# Altium project node 1.1.PrjPcb
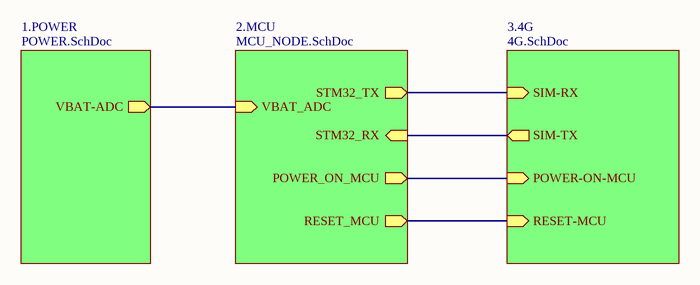
[diagram p0: NODE 1.1.SchDoc]
4 sheets, 115 parts. Net scope: hierarchical (ports join the sheet entries above them; power ports are global).
Sheets:
  NODE 1.1.SchDoc
    1.POWER = POWER.SchDoc
    2.MCU = MCU_NODE.SchDoc
    3.4G = 4G.SchDoc

## Sheet NODE 1.1.SchDoc
size A

### Sub-sheets
1.POWER = POWER.SchDoc: VBAT-ADC (out)
2.MCU = MCU_NODE.SchDoc: VBAT_ADC (in), STM32_TX (out), STM32_RX (in), POWER_ON_MCU (out), RESET_MCU (out)
3.4G = 4G.SchDoc: SIM-RX (in), SIM-TX (out), POWER-ON-MCU (in), RESET-MCU (in)

### Nets
NetC?#15_2: sheet 1.POWER/VBAT-ADC, sheet 2.MCU/VBAT_ADC
NetIC?#6_1: sheet 2.MCU/STM32_TX, sheet 3.4G/SIM-RX
NetIC?#6_8: sheet 2.MCU/STM32_RX, sheet 3.4G/SIM-TX
NetR?#26_2: sheet 2.MCU/RESET_MCU, sheet 3.4G/RESET-MCU
NetR?#28_2: sheet 2.MCU/POWER_ON_MCU, sheet 3.4G/POWER-ON-MCU

## Sheet POWER.SchDoc
size A
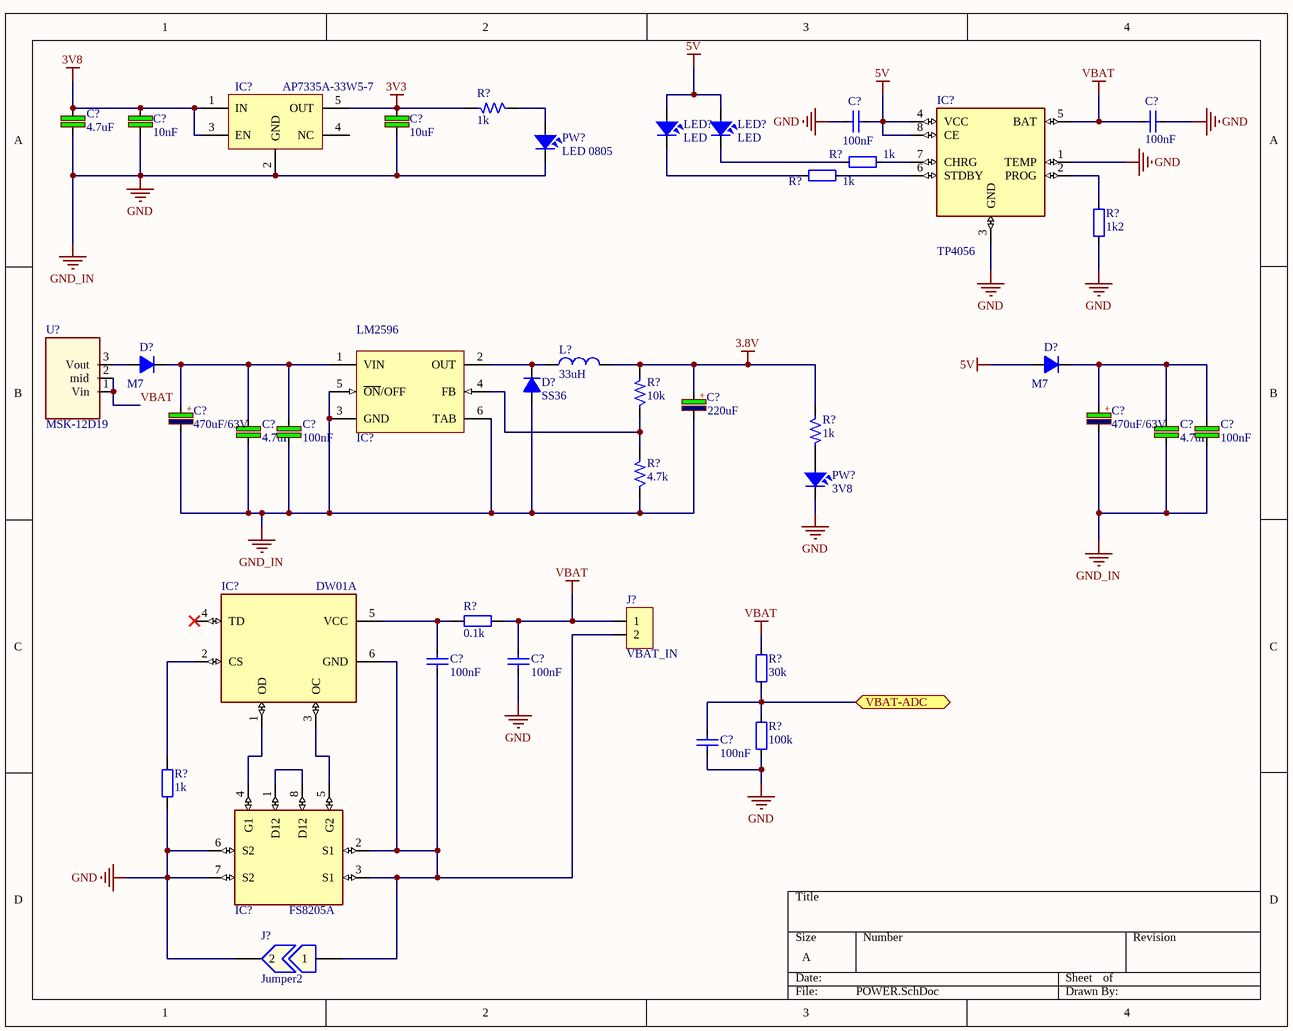
[diagram p1: POWER.SchDoc]

### Parts
(Parts that share a designator on the sheet are numbered #1, #2 ... from top to bottom, then left to right.)
C?#1  4.7uF  [C-0805]
C?#2  10nF  [C-0805]
C?#3  10uF  [C-0805]
C?#4  100nF  [CAP_0805]
C?#5  100nF  [CAP_0805]
C?#6  220uF  [EEFSDE]
C?#7  470uF/63V  [CAP-ALU-SMD-C]
C?#8  470uF/63V  [CAP-ALU-SMD-C]
C?#9  4.7uF  [C-0805]
C?#10  value 100nF  [C-0805]  (hidden comment: 4.7uF)
C?#11  4.7uF  [C-0805]
C?#12  value 100nF  [C-0805]  (hidden comment: 4.7uF)
C?#13  100nF  [CAP_0805]
C?#14  100nF  [CAP_0805]
C?#15  100nF  [CAP_0805]
D?#1  M7  [DIODE SMA]
D?#2  M7  [LED-0805-Blue]
D?#3  SS36  [DIODE SMA]
IC?#1  AP7335A-33W5-7  [SOT23-5]
IC?#2  TP4056  [TP4056]
IC?#3  LM2596  [TO-263]
IC?#4  DW01A  [SOT23-6]
IC?#5  FS8205A  [FS8205A]
J?#1  VBAT_IN  [JP2-D1T]
J?#2  Jumper2  [RES-SMD-0201]
L?#1  33uH  [Inductor_SMD]
LED?#1  LED  [LED-0805-Red]
LED?#2  LED  [LED-0805-Green]
PW?#1  LED 0805  [LED-0805-Blue]
PW?#2  3V8  [LED-0805-Blue]
R?#1  1k  [R-0805]
R?#2  1k  [RES-SMD-0805]
R?#3  1k  [RES-SMD-0805]
R?#4  1k2  [RES-SMD-0805]
R?#5  10k  [R-0805]
R?#6  1k  [R-0805]
R?#7  4.7k  [R-0805]
R?#8  0.1k  [RES-SMD-0805]
R?#9  30k  [RES-SMD-0805]
R?#10  100k  [RES-SMD-0805]
R?#11  1k  [RES-SMD-0805]
U?#1  MSK-12D19  [Switch]

### Ports
VBAT-ADC (bidir)

### Nets
3.8V: C?#6.1 L?#1.2 R?#5.2 R?#6.1
3V3: C?#3.1 IC?#1.5(OUT) R?#1.2
3V8: C?#1.2 C?#2.1 IC?#1.1(IN) IC?#1.3(EN)
5V: C?#4.1 D?#2.1(A) IC?#2.4(VCC) IC?#2.8(CE) LED?#1.1 LED?#2.1
GND: C?#1.1 C?#2.2 C?#3.2 C?#4.2 C?#5.1 C?#6.2 C?#7.2 C?#8.2 C?#9.1 C?#10.1 C?#11.1 C?#12.1 C?#14.1 C?#15.1 D?#3.1(A) IC?#1.2(GND) IC?#2.1(TEMP) IC?#2.3(GND) IC?#3.3(GND) IC?#3.5(~{ON}/OFF) IC?#3.6(TAB) IC?#5.6(S2) IC?#5.7(S2) J?#2.2 PW?#1.2 PW?#2.2 R?#4.1 R?#7.1 R?#10.2 R?#11.2  [also labelled GND_IN]
VBAT: C?#5.2 C?#14.2 IC?#2.5(BAT) J?#1.1 R?#8.2 R?#9.1 U?#1.1(Vin) U?#1.2(mid)
NetC?#7_1: C?#7.1 C?#9.2 C?#10.2 D?#1.2(K) IC?#3.1(VIN)
NetC?#8_1: C?#8.1 C?#11.2 C?#12.2 D?#2.2(K)
NetC?#13_1: C?#13.1 IC?#4.6(GND) IC?#5.2(S1) IC?#5.3(S1) J?#1.2 J?#2.1
NetC?#13_2: C?#13.2 IC?#4.5(VCC) R?#8.1
NetC?#15_2: C?#15.2 R?#9.2 R?#10.1 ; port VBAT-ADC
NetD?#1_1: D?#1.1(A) U?#1.3(Vout)
NetD?#3_2: D?#3.2(K) IC?#3.2(OUT) L?#1.1
NetIC?#2_2: IC?#2.2(PROG) R?#4.2
NetIC?#2_6: IC?#2.6(STDBY) R?#3.1
NetIC?#2_7: IC?#2.7(CHRG) R?#2.1
NetIC?#3_4: IC?#3.4(FB) R?#5.1 R?#7.2
NetIC?#4_1: IC?#4.1(OD) IC?#5.4(G1)
NetIC?#4_2: IC?#4.2(CS) R?#11.1
NetIC?#4_3: IC?#4.3(OC) IC?#5.5(G2)
NetIC?#5_1: IC?#5.1(D12) IC?#5.8(D12)
NetLED?#1_2: LED?#1.2 R?#3.2
NetLED?#2_2: LED?#2.2 R?#2.2
NetPW?#1_1: PW?#1.1 R?#1.1
NetPW?#2_1: PW?#2.1 R?#6.2

Not connected (* = marked no-connect by the designer): IC?#1 4(NC); IC?#4 4(TD)*

### Notes on the sheet
- (in symbol CP3) +
- (in symbol CP5) +

### Library data of the parts
C?#1 C?#9-C?#12 = C: 4.7µF ±10% 35V Ceramic Capacitor X5R 0805 (2012 Metric); Manufacturer: Samsung Electro-Mechanics; Part number: CL21A475KLCLQNC; User_Description: CAP CER 4.7UF 35V X5R 0805; Category: CAPACITOR; Package: 0805
  C?#1 C?#9 C?#11: Value: 4.7uF
C?#2 = C: Cap SMD; Manufacturer: Samsung Electro-Mechanics; Part number: CL21A106KPFNNNG; Value: 10uF; User_Description: CAP CER 10UF 10V X5R 0805; Category: CAPACITOR; Package: 0805
C?#3 = C: Cap SMD; Manufacturer: Samsung Electro-Mechanics; Part number: CL21A106KPFNNNG; User_Description: CAP CER 10UF 10V X5R 0805; Value: 10uF; Category: CAPACITOR; Package: 0805
C?#4 C?#5 C?#13-C?#15 = CapSMD: Capacitor; Value: 33p; Published: 8-Jun-2000; LatestRevisionDate: 17-Jul-2002; LatestRevisionNote: Re-released for DXP Platform.; PackageReference: RAD-0.3; Publisher: Altium Limited
C?#6 = CP5: 220µF Molded Tantalum Polymer Capacitor 16V 2917 (7343 Metric) 40mOhm @ 100kHz; Manufacturer: AVX Corporation; Part number: TCME227M016R0040E; User_Description: CAP TANT POLY 220UF 16V 2917; Value: 220uF; Category: CAPACITOR; Package: 2917
C?#7 C?#8 = CP3: Cap 470uF/63V; Value: Cap 470uF/63V
D?#1 D?#2 = D1A: Diode 1A; Value: 1N4007
D?#3 = B340A: Diode Schottky 40V 3A Surface Mount DO-214AC (SMA); Manufacturer: Vishay General Semiconductor - Diodes Division; Part number: B340A-M3/61T; User_Description: DIODE SCHOTTKY 40V 3A DO214AC; Value: 40V 3A; Category: DIODE; Package: DO214AC
IC?#2 = TP4056: Complete single cell Li-Ion battery with a constant current / constant voltage linear charger
IC?#3 = LM2576
IC?#4 = DW01A: One Cell Lithium-ion/Polymer Battery Protection IC
J?#1 = JP2: WR-PHD 2.54 mm Angled Socket Header; Manufacturer: W¨¹rth Elektronik eiSos GmbH; partNo: 613002143121; ComponentLink1 Description: Manufacturer; ComponentLink2 Description: Datasheet; NoPins: 02; Created Date: 29 March 2013; ComponentLink1URL: http://www.we-online.com; ComponentLink2URL: http://katalog.we-online.de/em/datasheet/6130xx143121.pdf; Created by: Karrer Zheng
J?#2 = Jumper2: Jumper, 2-Pin
L?#1 = L1: 22µH Shielded Inductor 1.65A 96mOhm Max Nonstandard; Manufacturer: Bourns Inc.; Part Number: SRR0745A-220M; Value: 220uH; User_Description: FIXED IND 22UH 1.65A 96 MOHM SMD; Category: INDUCTORS; Package: SMD
LED?#1 LED?#2 = LED: LED Single colour Green and Red; Value: LED 3 ly Single Colour
PW?#1 PW?#2 = LED: LED RED DIFFUSED 0805 SMD; Manufacturer: OSRAM Opto Semiconductors Inc.; Part number: LS R976-NR-1; Value: Red; Category: LED SMD; Package: 0805; User_Description: LED RED DIFFUSED 0805 SMD
R?#1 R?#6 = R: Resistor 1/4W; Manufacturer: Yageo; Part number: RC0805FR-071KL; User_Description: RES SMD 1K OHM 1% 1/8W 0805; Value: 1k; Category: RESISTORS; Package: 0805
R?#2-R?#4 R?#9 R?#10 = Resistor - SMD: Resistor; Manufacturer: Generic Components; Class: Passive; Published: 08/06/2000; Publisher: Altium Hobart Technology Centre
R?#5 = R: RES SMD 10K OHM 1% 1/8W 0805; Manufacturer: Yageo; Part number: RC0805FR-0710KL; Category: RESISTORS; Package: 0805; User_Description: RES SMD 10K OHM 1% 1/8W 0805; Value: 10k
R?#7 = R: RES SMD 3.3K OHM 1% 1/8W 0805; Manufacturer: Yageo; Part number: RC0805FR-073K3L; Category: RESISTORS; Package: 0805; User_Description: RES SMD 3.3K OHM 1% 1/8W 0805; Value: 3.3k
R?#8 R?#11 = Resistor - SMD: Resistor SMD; Manufacturer: Generic Components; Class: Passive; Published: 08/06/2000; Publisher: Altium Hobart Technology Centre
U?#1 = switch
IC?#1 = AP7335A-33W5-7: Package: SOT23-5; Part number: AP7335A-33W5-7

## Sheet MCU_NODE.SchDoc
size A
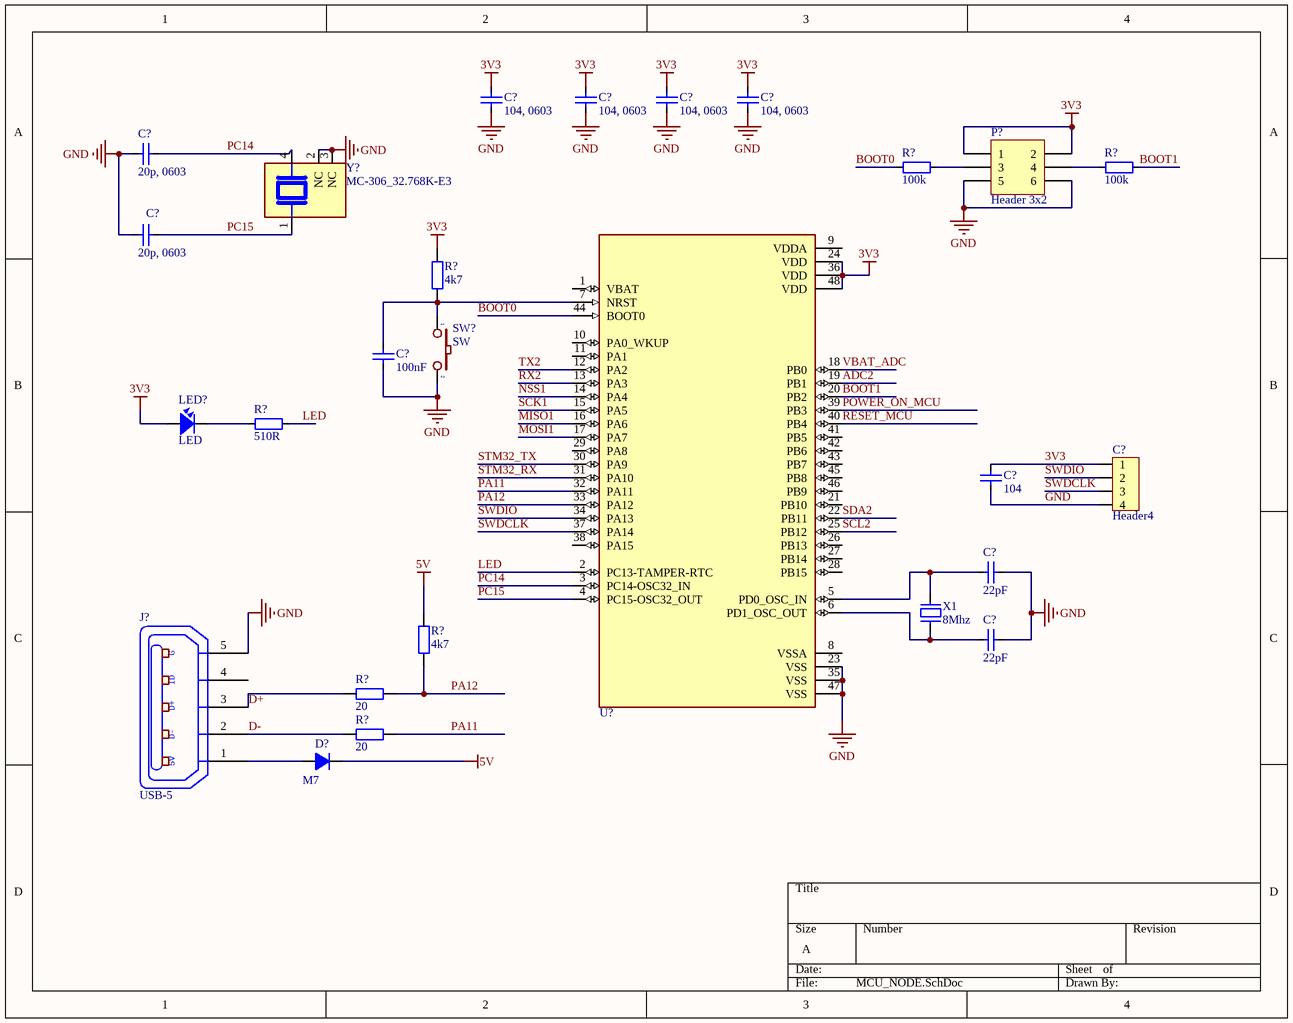
[diagram p2: MCU_NODE.SchDoc]

### Parts
(Parts that share a designator on the sheet are numbered #1, #2 ... from top to bottom, then left to right.)
C?#16  104, 0603  [CAP_0805]
C?#17  104, 0603  [CAP_0805]
C?#18  104, 0603  [CAP_0805]
C?#19  104, 0603  [CAP_0805]
C?#20  20p, 0603  [CAP_0805]
C?#21  20p, 0603  [CAP_0805]
C?#22  100nF  [CAP_0402]
C?#23  Header4  [HDR4]
C?#24  104  [CAP_0402]
C?#25  22pF  [CAP_0402]
C?#26  22pF  [CAP_0402]
D?#4  M7  [LED-0805-Blue]
J?#3  USB-5  [USB-M1]
LED?#3  LED  [LED-0805-Blue]
P?#1  Header 3x2  [Header 3x2]
R?#12  100k  [RES-SMD-0805]
R?#13  100k  [RES-SMD-0805]
R?#14  4k7  [RES-SMD-0805]
R?#15  510R  [RES-SMD-0805]
R?#16  4k7  [RES-SMD-0805]
R?#17  20  [RES-SMD-0805]
R?#18  20  [RES-SMD-0101]
SW?#1  SW  [SW2]
U?#2  STM32  [LQFP 48]  (value not drawn)
X1  8Mhz  [XT2]
Y?  MC-306_32.768K-E3  [XTAL_MC-306_32.768K-E3]

### Nets
3V3: C?#16.2 C?#17.2 C?#18.2 C?#19.2 C?#23.1 C?#24.2 LED?#3.1 P?#1.1 P?#1.2 R?#14.1 U?#2.24(VDD) U?#2.36(VDD) U?#2.48(VDD)
5V: D?#4.2(K) R?#16.2
GND: C?#16.1 C?#17.1 C?#18.1 C?#19.1 C?#20.1 C?#21.1 C?#22.1 C?#23.4 C?#24.1 C?#25.2 C?#26.2 J?#3.5(P5) P?#1.5 P?#1.6 SW?#1.2 U?#2.23(VSS) U?#2.35(VSS) U?#2.47(VSS) Y?.2(NC) Y?.3(NC)
ADC2: U?#2.19(PB1)
BOOT0: R?#12.2 U?#2.44(BOOT0)
BOOT1: R?#13.1 U?#2.20(PB2)
D+: J?#3.3(P3) R?#17.1
D-: J?#3.2(P2) R?#18.1
LED: R?#15.1 U?#2.2(PC13-TAMPER-RTC)
MISO1: U?#2.16(PA6)
MOSI1: U?#2.17(PA7)
NSS1: U?#2.14(PA4)
PA11: R?#18.2 U?#2.32(PA11)
PA12: R?#16.1 R?#17.2 U?#2.33(PA12)
PC14: C?#20.2 U?#2.3(PC14-OSC32_IN) Y?.4
PC15: C?#21.2 U?#2.4(PC15-OSC32_OUT) Y?.1
POWER_ON_MCU: U?#2.39(PB3)
RESET_MCU: U?#2.40(PB4)
RX2: U?#2.13(PA3)
SCK1: U?#2.15(PA5)
SCL2: U?#2.25(PB12)
SDA2: U?#2.22(PB11)
STM32_RX: U?#2.31(PA10)
STM32_TX: U?#2.30(PA9)
SWDCLK: C?#23.3 U?#2.37(PA14)
SWDIO: C?#23.2 U?#2.34(PA13)
TX2: U?#2.12(PA2)
VBAT_ADC: U?#2.18(PB0)
NetC?#22_2: C?#22.2 R?#14.2 SW?#1.1 U?#2.7(NRST)
NetC?#25_1: C?#25.1 U?#2.5(PD0_OSC_IN) X1.2
NetC?#26_1: C?#26.1 U?#2.6(PD1_OSC_OUT) X1.1
NetD?#4_1: D?#4.1(A) J?#3.1(P1)
NetLED?#3_2: LED?#3.2 R?#15.2
NetP?#1_3: P?#1.3 R?#12.1
NetP?#1_4: P?#1.4 R?#13.2

Not connected (* = marked no-connect by the designer): J?#3 4(P4); U?#2 1(VBAT) 8(VSSA) 9(VDDA) 10(PA0_WKUP) 11(PA1) 21(PB10) 26(PB13) 27(PB14) 28(PB15) 29(PA8) 38(PA15) 41(PB5) 42(PB6) 43(PB7) 45(PB8) 46(PB9)

### Notes on the sheet
- (in symbol USB-5) G; ID; D+; D-; 5V

### Library data of the parts
C?#16-C?#22 C?#24-C?#26 = CapSMD: Capacitor; Value: 33p; Published: 8-Jun-2000; LatestRevisionDate: 17-Jul-2002; LatestRevisionNote: Re-released for DXP Platform.; PackageReference: RAD-0.3; Publisher: Altium Limited
C?#23 = Header4: Header IDC, 4 x 1 Pin Vertical 2.54mm Pitch (Non-Boxed, Male); Manufacturer: W¨¹rth Elektronik eiSos GmbH; partNo: 613002143121; ComponentLink1 Description: Manufacturer; ComponentLink2 Description: Datasheet; NoPins: 02; Created Date: 29 March 2013; ComponentLink1URL: http://www.we-online.com; ComponentLink2URL: http://katalog.we-online.de/em/datasheet/6130xx143121.pdf; Created by: Karrer Zheng
D?#4 = D1A: Diode 1A; Value: 1N4007
J?#3 = USB-5: Manufacturer: FCI; Manufacturer Part Number: 10118193-0001LF; Connector Type: USB - micro B; Number of Contacts: 5; Gender: Receptacle; Specifications: USB 2.0; .Creator: MM; .Checked PCB: RF; Supplier 1: Digi-Key; RoHS: RoHS Compliant; Category: Connectors, Interconnects; Stock 1: 28642; Pricing 1: 1=0.46, 10=0.433, 25=0.3712, 50=0.3156, 100=0.3032, 250=0.27224, 500=0.25988 (USD); Packaging: Cut Tape (CT); Mounting Type: Surface Mount, Right Angle, Horizontal; Features: Shielded, Solder Retention; Ingress Protection: -; ComponentLink1URL: http://portal.fciconnect.com/Comergent//fci/drawing/10118193.pdf; ComponentLink1Description: http://portal.fciconnect.com/Comergent//fci/drawing/10118193.pdf; Supplier Part Number 1: 609-4616-1-ND; .Checked SCH: MM
LED?#3 = LED: as LED?#1 on sheet POWER
P?#1 = Header 3x2: Header, 6-Pin, 2-Row; LatestRevisionDate: 17-Jul-2002; LatestRevisionNote: Re-released for DXP Platform.; Publisher: Altium Limited
R?#12 R?#13 R?#15 = Resistor - SMD: as R?#2 on sheet POWER; Published: 08/06/2000; Publisher: Altium Hobart Technology Centre
R?#14 R?#16-R?#18 = Resistor - SMD: as R?#8 on sheet POWER; Published: 08/06/2000; Publisher: Altium Hobart Technology Centre
SW?#1 = SW2: Switch button 2 pin; Value: SW chip 2 pin
U?#2 = STM32F103C8T6: STM32 ARM-based 32-bit MCU with 64 Kbytes Flash, 64-pin LQFP, Industrial Temperature
X1 = XT2: Crystal For all Crystal 2pin.; Value: 4Mhz
Y? = MC-306_32.768K-E3: CRYSTAL 32.7680KHZ 6PF SMD; MF: EPSON; MP: MC-306 32.768K-E3; Check_prices: https://www.snapeda.com/parts/MC-306%2032.768K-E3/EPSON/view-part/?ref=eda; Package: NON STANDARD-4 EPSON; Value: *; Price: None; Purchase-URL: https://pricing.snapeda.com/search/part/MC-306 32.768K-E3/?ref=eda; SnapEDA_Link: https://www.snapeda.com/parts/MC-306%2032.768K-E3/EPSON/view-part/?ref=snap; Availability: In Stock

## Sheet 4G.SchDoc
size B
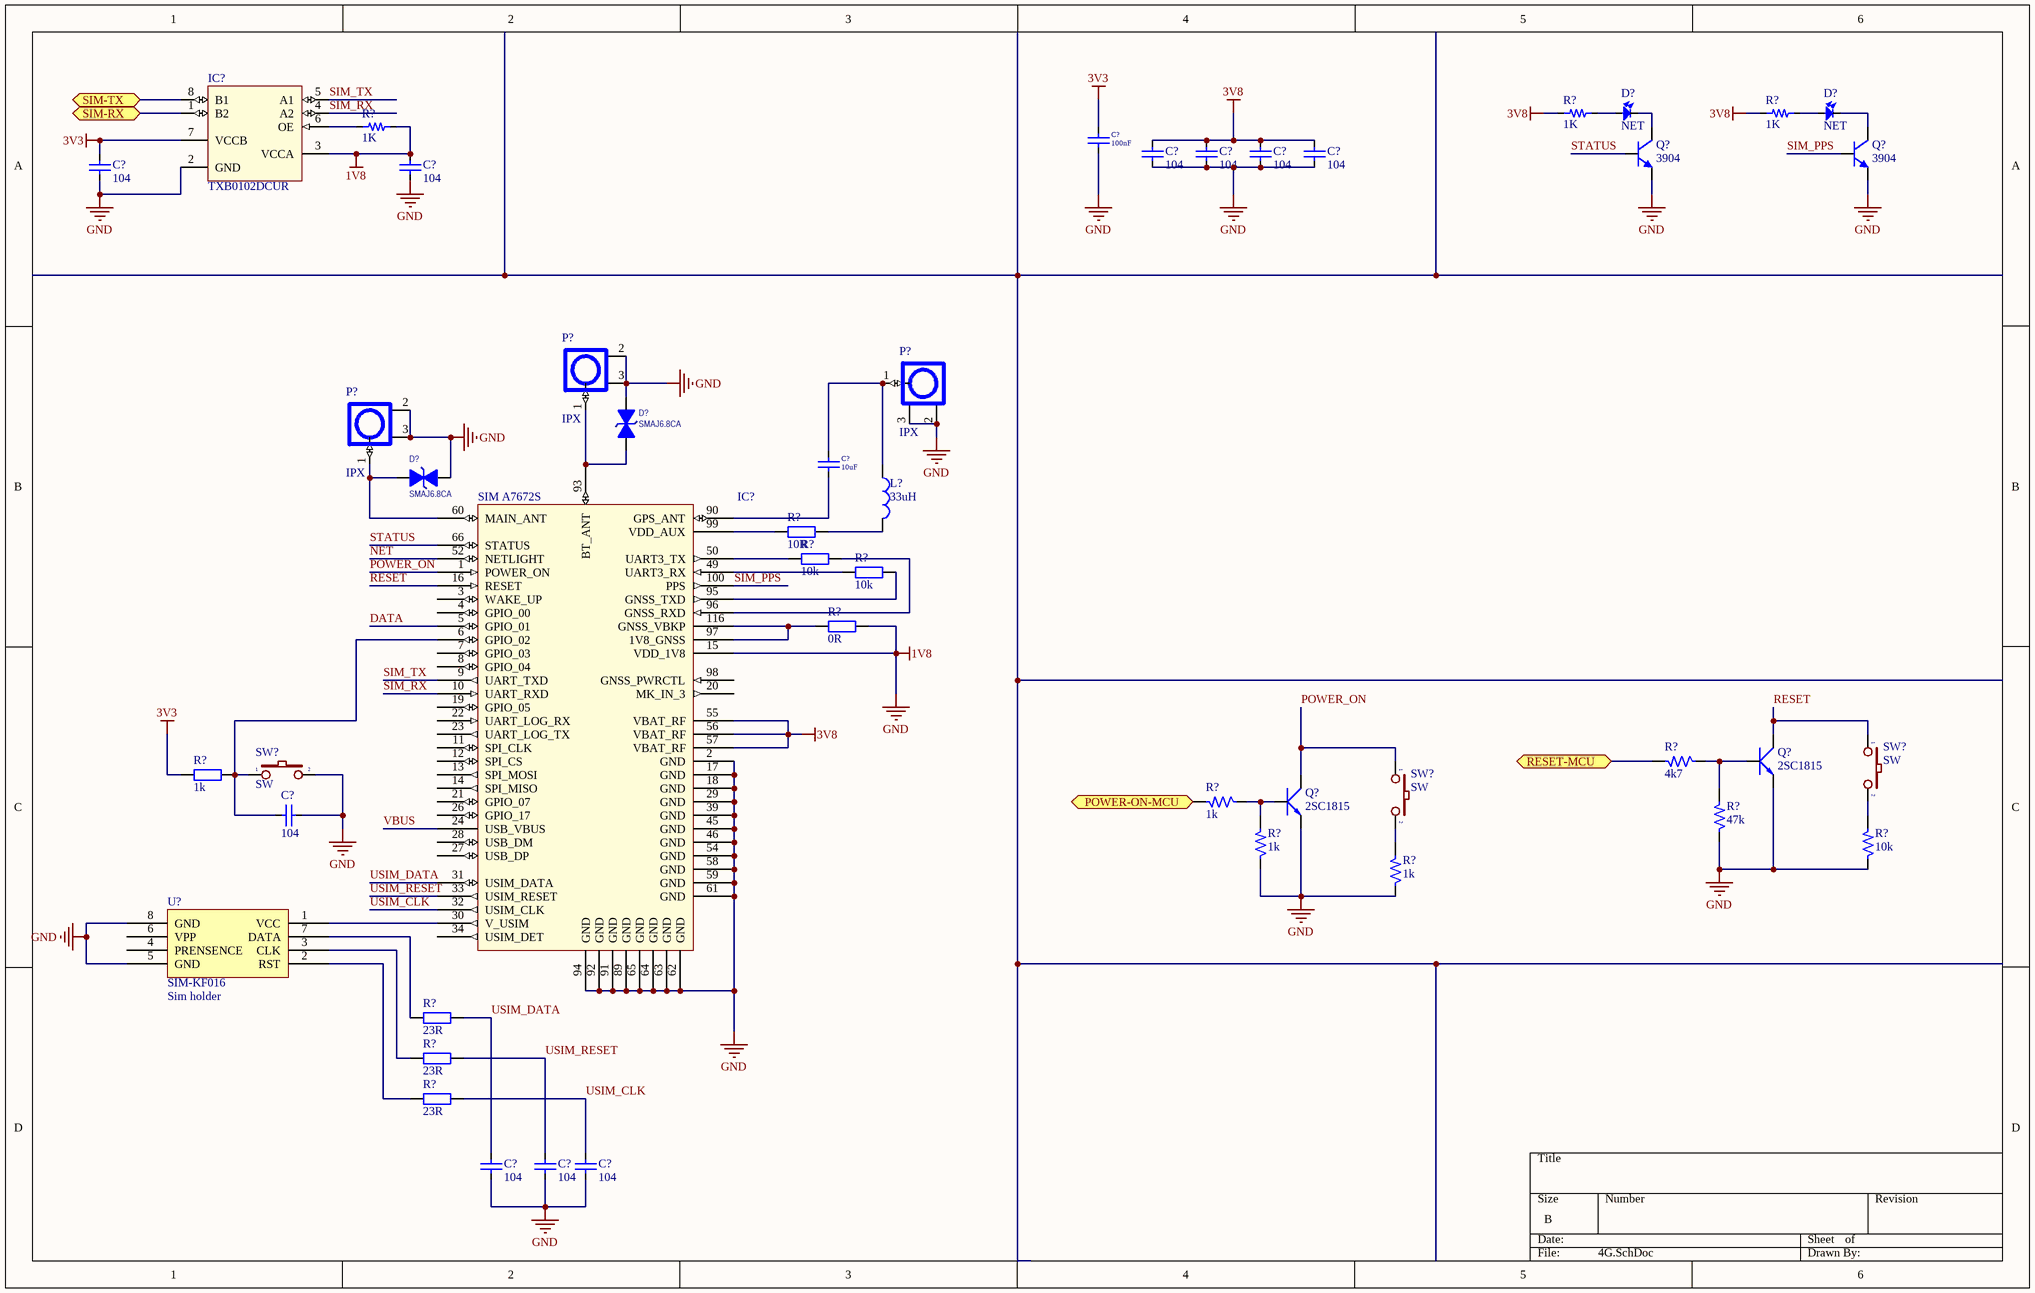
[diagram p3: 4G.SchDoc]

### Parts
(Parts that share a designator on the sheet are numbered #1, #2 ... from top to bottom, then left to right.)
C?#27  100nF  [CAP_0402]
C?#28  104  [CAP_0402]
C?#29  104  [CAP_0402]
C?#30  104  [CAP_0402]
C?#31  104  [CAP_0402]
C?#32  104  [CAP_0402]
C?#33  104  [CAP_0402]
C?#34  10uF  [CAP_0402]
C?#35  104  [CAP_0402]
C?#36  104  [CAP_0402]
C?#37  104  [CAP_0402]
C?#38  104  [CAP_0402]
D?#5  NET  [LED-3]
D?#6  NET  [LED-3]
D?#7  SMAJ6.8CA  [SOD323 - DO241]
D?#8  SMAJ6.8CA  [SOD323 - DO241]
IC?#6  TXB0102DCUR  [SOP50P310X90-8N]
IC?#7  SIM A7672S  [A7672S]
L?#2  33uH  [Inductor_SMD]
P?#2  IPX  [IPXS]
P?#3  IPX  [IPXS]
P?#4  IPX  [IPXS]
Q?#1  3904  [TRAN-LOWPOWER]
Q?#2  3904  [TRAN-LOWPOWER]
Q?#3  2SC1815  [TO92-123]
Q?#4  2SC1815  [TO92-123]
R?#19  1K  [RES-SMD-0101]
R?#20  1K  [RES-SMD-0101]
R?#21  1K  [RES-SMD-0101]
R?#22  10R  [RES-SMD-0805]
R?#23  10k  [RES-SMD-0805]
R?#24  10k  [RES-SMD-0805]
R?#25  0R  [RES-SMD-0805]
R?#26  4k7  [SM-1206]
R?#27  1k  [RES-SMD-0805]
R?#28  1k  [SM-1206]
R?#29  47k  [SM-1206]
R?#30  1k  [SM-1206]
R?#31  10k  [SM-1206]
R?#32  1k  [SM-1206]
R?#33  23R  [RES-SMD-0805]
R?#34  23R  [RES-SMD-0805]
R?#35  23R  [RES-SMD-0805]
SW?#2  SW  [SW2]
SW?#3  SW  [SW2]
SW?#4  SW  [SW2]
U?#3  SIM-KF016  value Sim holder  [Sim Socket]

### Ports
POWER-ON-MCU (bidir), RESET-MCU (bidir), SIM-RX (bidir), SIM-TX (bidir)

### Nets
3V3: C?#27.2 C?#32.2 IC?#6.7(VCCB) R?#27.2
3V8: C?#28.2 C?#29.2 C?#30.2 C?#31.2 IC?#7.55(VBAT_RF) IC?#7.56(VBAT_RF) IC?#7.57(VBAT_RF) R?#19.1 R?#20.1
GND: C?#27.1 C?#28.1 C?#29.1 C?#30.1 C?#31.1 C?#32.1 C?#33.1 C?#33.2 C?#35.1 C?#36.2 C?#37.2 C?#38.2 D?#7.2(K) D?#8.1(A) IC?#6.2(GND) IC?#6.3(VCCA) IC?#7.2(GND) IC?#7.15(RESERVED) IC?#7.17(GND) IC?#7.18(GND) IC?#7.29(KEYPAD_0) IC?#7.39(GND) IC?#7.45(GND) IC?#7.46(ADC2) IC?#7.54(GPIO4) IC?#7.58(GND) IC?#7.59(GND) IC?#7.61(GND) IC?#7.62(GND) IC?#7.63(GND) IC?#7.64(GND) IC?#7.65(GND) IC?#7.89(GND) IC?#7.91(GND) IC?#7.92(GND) IC?#7.94(GND) P?#2.2 P?#2.3 P?#3.2 P?#3.3 P?#4.2 P?#4.3 Q?#1.2(E) Q?#2.2(E) Q?#3.1(E) Q?#4.1(E) R?#21.2 R?#25.1 R?#29.1 R?#30.1 R?#31.1 R?#32.1 SW?#3.2 U?#3.5(GND) U?#3.8(GND)  [also labelled 1V8]
DATA: IC?#7.5(GPIO_01)
NET: IC?#7.52(GPIO41)
POWER_ON: IC?#7.1(POWER_ON) Q?#4.2(C) SW?#4.1
RESET: IC?#7.16(RESERVED) Q?#3.2(C) SW?#2.1
SIM_PPS: IC?#7.100(PPS) Q?#2.1(B)
SIM_RX: IC?#6.4(A2) IC?#7.10(UART_RXD)
SIM_TX: IC?#6.5(A1) IC?#7.9(UART_TXD)
STATUS: IC?#7.66(STATUS) Q?#1.1(B)
USIM_CLK: C?#38.1 IC?#7.32(KEYSENSE_N3) R?#35.1
USIM_DATA: C?#36.1 IC?#7.31(KEYSENSE_N2) R?#33.1
USIM_RESET: C?#37.1 IC?#7.33(KEYPAD_1) R?#34.1
VBUS: IC?#7.24(MIC1N)
NetC?#34_1: C?#34.1 IC?#7.90(GPS_ANT)
NetC?#34_2: C?#34.2 L?#2.1 P?#3.1
NetC?#35_2: C?#35.2 IC?#7.6(GPIO_02) R?#27.1 SW?#3.1
NetD?#5_1: D?#5.1 R?#19.2
NetD?#5_2: D?#5.2 Q?#1.3(C)
NetD?#6_1: D?#6.1 R?#20.2
NetD?#6_2: D?#6.2 Q?#2.3(C)
NetD?#7_1: D?#7.1(A) IC?#7.93(BT_ANT) P?#2.1
NetD?#8_2: D?#8.2(K) IC?#7.60(MAIN_ANT) P?#4.1
NetIC?#6_1: IC?#6.1(B2) ; port SIM-RX
NetIC?#6_6: IC?#6.6(OE) R?#21.1
NetIC?#6_8: IC?#6.8(B1) ; port SIM-TX
NetIC?#7_30: IC?#7.30(KEYPAD_2) U?#3.1(VCC)
NetIC?#7_49: IC?#7.49(GPIO40) R?#24.2
NetIC?#7_50: IC?#7.50(GPIO43) R?#23.2
NetIC?#7_95: IC?#7.95(GNSS_TXD) R?#24.1
NetIC?#7_96: IC?#7.96(GNSS_RXD) R?#23.1
NetIC?#7_97: IC?#7.97(1V8_GNSS) IC?#7.116(GNSS_VBKP) R?#25.2
NetIC?#7_99: IC?#7.99(VDD_AUX) R?#22.2
NetL?#2_2: L?#2.2 R?#22.1
NetQ?#3_3: Q?#3.3(B) R?#26.1 R?#29.2
NetQ?#4_3: Q?#4.3(B) R?#28.1 R?#30.2
NetR?#26_2: R?#26.2 ; port RESET-MCU
NetR?#28_2: R?#28.2 ; port POWER-ON-MCU
NetR?#31_2: R?#31.2 SW?#2.2
NetR?#32_2: R?#32.2 SW?#4.2
NetR?#33_2: R?#33.2 U?#3.7(DATA)
NetR?#34_2: R?#34.2 U?#3.3(CLK)
NetR?#35_2: R?#35.2 U?#3.2(RST)

Not connected (* = marked no-connect by the designer): IC?#7 3(WAKE_UP) 4(GPIO_00) 7(GPIO_03) 8(GPIO_04) 11(SPI_CLK) 12(SPI_CS) 13(SPI_MOSI) 14(SPI_MISO) 19(GPIO_05) 20(MK_IN_3) 21(SPK_M) 22(SPK_P) 23(MIC1P) 25(EAR1N) 26(EAR1P) 27(KEYSENSE_N1) 28(KEYSENSE_N0) 34(KEYPAD_4) 35(KEYPAD_3) 36(KEYSENSE_N4) 47(ADC1) 48(GPIO44) 51(GPIO1) 53(GPIO42) 73(PCM_DOUT) 74(PCM_DIN) 75(PCM_SYNC) 76(PCM_CLK) 98(GNSS_PWRCTL); U?#3 4(PRENSENCE) 6(VPP)

### Library data of the parts
C?#27 = CapSMD_5: Capacitor; Value: 33p; Published: 8-Jun-2000; LatestRevisionDate: 17-Jul-2002; LatestRevisionNote: Re-released for DXP Platform.; PackageReference: RAD-0.3; Publisher: Altium Limited
C?#28-C?#33 = CapSMD_9: Capacitor; Value: 33p; Published: 8-Jun-2000; LatestRevisionDate: 17-Jul-2002; LatestRevisionNote: Re-released for DXP Platform.; PackageReference: RAD-0.3; Publisher: Altium Limited
C?#34 = CapSMD_1: Capacitor; Value: 33p; Published: 8-Jun-2000; LatestRevisionDate: 17-Jul-2002; LatestRevisionNote: Re-released for DXP Platform.; PackageReference: RAD-0.3; Publisher: Altium Limited
C?#35-C?#38 = CapSMD: Capacitor; Value: 33p; Published: 8-Jun-2000; LatestRevisionDate: 17-Jul-2002; LatestRevisionNote: Re-released for DXP Platform.; PackageReference: RAD-0.3; Publisher: Altium Limited
D?#5 D?#6 = LED_2: LED Single colour Green and Red; Value: LED 3 ly Single Colour
D?#7 D?#8 = SMAJ30CA-30V/8.3A: TVS DIODE 30VWM 48.4VC SMA; Manufacturer: Bourns Inc.; Part number: PSD12C; Category: Circuit Protection; Package: SOD323; User_Description: TVS DIODE 30VWM 48.4VC SMA
IC?#6 = TXB0102DCUR: IC TRNSLTR BIDIRECTIONAL US8; Manufacturer: Texas Instruments; Category: IC Logic Level; Package: 8-VSSOP; Part number: TXB0102DCUR; User_Description: IC TRNSLTR BIDIRECTIONAL US8
IC?#7 = SIM A7672S: SIM A7672S-CAT-M1; Part number: SIM A7672S
L?#2 = L1: as L?#1 on sheet POWER; Category: INDUCTORS; Package: SMD
P?#2-P?#4 = IPXSx66: Antenna GSM GPS; Manufacturer: TE Connectivity AMP Connectors; Part number: 2334884-1; User_Description: UMCC MICRO-COAX RECEPTACLE, GEN; Category: Connectors; Package: SMD
Q?#1 Q?#2 = MMBT3904
Q?#3 Q?#4 = 2SC1815: NPN 600mW, ECB; Value: C1815
R?#19-R?#21 = Resistor - SMD: as R?#2 on sheet POWER; Published: 08/06/2000; Publisher: Altium Hobart Technology Centre
R?#22-R?#25 R?#27 R?#33-R?#35 = Resistor - SMD: as R?#8 on sheet POWER; Published: 08/06/2000; Publisher: Altium Hobart Technology Centre
R?#26 R?#28-R?#32 = R: Resistor 1/4W; Value: R1/4W - 1K
SW?#2-SW?#4 = SW2: as SW?#1 on sheet MCU_NODE
U?#3 = Sim holder: SIM Card Holder KF-016

## Nets that join several sheets
3V3: POWER (C?#3.1 IC?#1.5 R?#1.2), MCU_NODE (13 pins), 4G (C?#27.2 C?#32.2 IC?#6.7 R?#27.2)
3V8: POWER (C?#1.2 C?#2.1 IC?#1.1 IC?#1.3), 4G (9 pins)
5V: POWER (6 pins), MCU_NODE (D?#4.2 R?#16.2)
GND: POWER (30 pins), MCU_NODE (20 pins), 4G (55 pins)